# EAGLE schematic DashHubV5 (EAGLE 9.6.2)
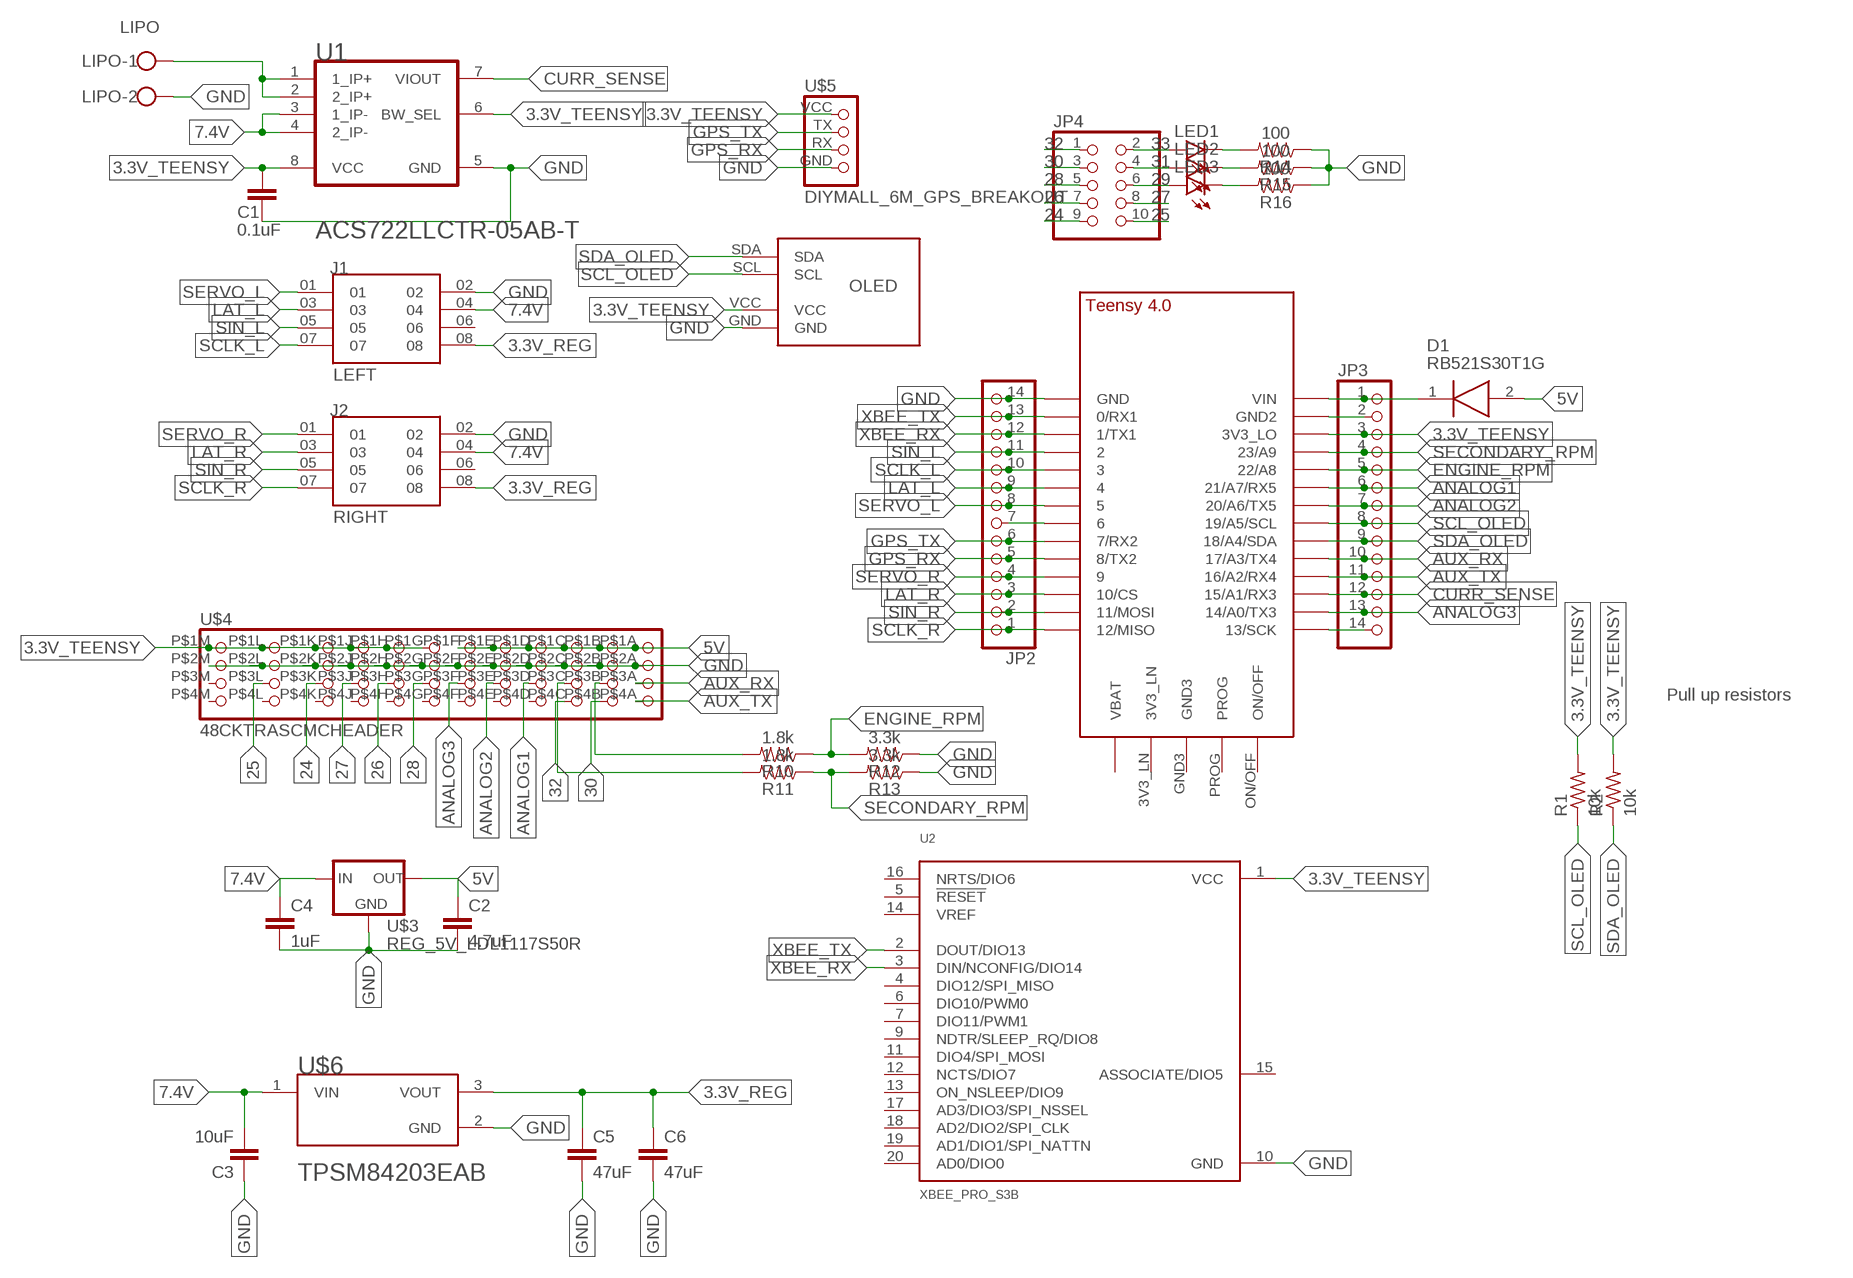
[diagram p0: schematic, sheet 1]

## Parts
C1  0.1uF  C-EUC0402  [C0402]
C2  4.7uF  CAP_SMDC0603  [C0603]
C3  10uF  CAP_SMDC1206  [C1206]
C4  1uF  CAP_SMDC1206  [C1206]
C5  47uF  CAP_SMDC1206  [C1206]
C6  47uF  CAP_SMDC1206  [C1206]
D1  RB521S30T1G  [SODFL1608X70N]
J1  LEFT  ESW-104-23-L-D  [SAMTEC_ESW-104-23-L-D]
J2  RIGHT  ESW-104-23-L-D  [SAMTEC_ESW-104-23-L-D]
JP2  PINHD-1X14  [1X14]
JP3  PINHD-1X14  [1X14]
JP4  PINHD-2X5  [2X05]
LED1  LEDCHIPLED_1206  [CHIPLED_1206]
LED2  LEDCHIPLED_1206  [CHIPLED_1206]
LED3  LEDCHIPLED_1206  [CHIPLED_1206]
LIPO  LIPO  W237-102  [W237-102]
R1  10k  RES_SMDR0603  [R0603]
R2  10k  RES_SMDR0603  [R0603]
R10  1.8k  RESISTORAXIAL-0.3  [AXIAL-0.3]
R11  1.8k  RESISTORAXIAL-0.3  [AXIAL-0.3]
R12  3.3k  RESISTORAXIAL-0.3  [AXIAL-0.3]
R13  3.3k  RESISTORAXIAL-0.3  [AXIAL-0.3]
R14  100  RESISTORAXIAL-0.3  [AXIAL-0.3]
R15  100  RESISTORAXIAL-0.3  [AXIAL-0.3]
R16  100  RESISTORAXIAL-0.3  [AXIAL-0.3]
U1  ALLEGRO_MICROSYSTEMS_ACS722LLCTR-05AB-TALLEGRO_MICROSYSTEMS_ACS722LLCTR-05AB-T_0_0  [ALLEGRO_MICROSYSTEMS_ACS722LLCTR-05AB-T_0]
U2  XBEE_PRO_S3B  [XBEE_PRO_S3B]
U$1  TEENSY_4.0-BASIC  [TEENSY_4.0-BASIC]
U$2  OLED_SSD1306  [OLED_SSD1306]
U$3  REG_5V_LDL1117S50R  [SOT230P700X180-4N]
U$4  48CKTRASCMCHEADER  [48CKTRASCMCHEADER]
U$5  DIYMALL_6M_GPS_BREAKOUT  [DIYMALL_6M_GPS_BREAKOUT]
U$6  TPSM84205EAB  [TPSM84205EAB]

## Nets
3.3V_REG: C5.1 C6.1 J1.08 J2.08 U$6.3(VOUT)
3.3V_TEENSY: C1.2 JP3.3 R1.2 R2.2 U1.6(BW_SEL) U1.8(VCC) U2.1(VCC) U$1.3V3_LO U$2.VCC U$4.P$1G(1G) U$4.P$1H(1H) U$4.P$1J(1J) U$4.P$1K(1K) U$4.P$1L(1L) U$4.P$1M(1M) U$5.VCC
5V: C2.1 D1.2(A) U$3.2(OUT) U$3.4(OUT) U$4.P$1A(1A) U$4.P$1B(1B) U$4.P$1C(1C) U$4.P$1D(1D) U$4.P$1E(1E) U$4.P$1F(1F)
7.4V: C3.2 C4.1 J1.04 J2.04 U1.3(1_IP-) U1.4(2_IP-) U$3.3(IN) U$6.1(VIN)
24: JP4.9 U$4.P$3K(3K)
25: JP4.10 U$4.P$3L(3L)
26: JP4.7 U$4.P$3H(3H)
27: JP4.8 U$4.P$3J(3J)
28: JP4.5 U$4.P$3G(3G)
29: JP4.6 LED3.A
30: JP4.3 U$4.P$4B(4B)
31: JP4.4 LED2.A
32: JP4.1 U$4.P$4C(4C)
33: JP4.2 LED1.A
ANALOG1: JP3.6 U$1.21/A7(21/A7/RX5) U$4.P$3D(3D)
ANALOG2: JP3.7 U$1.20/A6(20/A6/TX5) U$4.P$3E(3E)
ANALOG3: JP3.13 U$1.14/A0(14/A0/TX3) U$4.P$3F(3F)
AUX_RX: JP3.10 U$1.17/A3(17/A3/TX4) U$4.P$3A(3A)
AUX_TX: JP3.11 U$1.16/A2(16/A2/RX4) U$4.P$4A(4A)
CURR_SENSE: JP3.12 U1.7(VIOUT) U$1.15/A1(15/A1/RX3)
ENGINE_RPM: JP3.5 R10.P$1 R12.P$2 U$1.22/A8
GND: C1.1 C2.2 C3.1 C4.2 C5.2 C6.2 J1.02 J2.02 JP2.14 LIPO.2 R12.P$1 R13.P$1 R14.P$1 R15.P$1 R16.P$1 U1.5(GND) U2.10(GND) U$1.GND U$2.GND U$3.1(GND) U$4.P$2A(2A) U$4.P$2B(2B) U$4.P$2C(2C) U$4.P$2D(2D) U$4.P$2E(2E) U$4.P$2F(2F) U$4.P$2G(2G) U$4.P$2H(2H) U$4.P$2J(2J) U$4.P$2K(2K) U$4.P$2L(2L) U$4.P$2M(2M) U$5.GND U$6.2(GND)
GND2: JP3.2 U$1.GND2
GPS_RX: JP2.5 U$1.8(8/TX2) U$5.RX
GPS_TX: JP2.6 U$1.7(7/RX2) U$5.TX
LAT_L: J1.03 JP2.9 U$1.4/CANRX
LAT_R: J2.03 JP2.3 U$1.10/CS
LIPO_IN: LIPO.1 U1.1(1_IP+) U1.2(2_IP+)
N$1: JP2.7 U$1.6
N$2: D1.1(K) JP3.1 U$1.VIN
N$11: LED1.C R14.P$2
N$12: LED2.C R15.P$2
N$13: LED3.C R16.P$2
N$23: R10.P$2 U$4.P$3B(3B)
N$24: R11.P$2 U$4.P$3C(3C)
SCL_OLED: JP3.8 R1.1 U$1.19/A5/SCL U$2.SCL
SCLK_D: JP3.14 U$1.13/SCK
SCLK_L: J1.07 JP2.10 U$1.3/CANTX
SCLK_R: J2.07 JP2.1 U$1.12/MISO
SDA_OLED: JP3.9 R2.1 U$1.18/A4/SDA U$2.SDA
SECONDARY_RPM: JP3.4 R11.P$1 R13.P$2 U$1.23/A9
SERVO_L: J1.01 JP2.8 U$1.5
SERVO_R: J2.01 JP2.4 U$1.9/CS
SIN_L: J1.05 JP2.11 U$1.2
SIN_R: J2.05 JP2.2 U$1.11/MOSI
XBEE_RX: JP2.12 U2.3(DIN/NCONFIG/DIO14) U$1.1/TX(1/TX1)
XBEE_TX: JP2.13 U2.2(DOUT/DIO13) U$1.0/RX(0/RX1)
Unconnected: J1.06 J2.06 U2.4(DIO12/SPI_MISO) U2.5(!RESET) U2.6(DIO10/PWM0) U2.7(DIO11/PWM1) U2.9(NDTR/SLEEP_RQ/DIO8) U2.11(DIO4/SPI_MOSI) U2.12(NCTS/DIO7) U2.13(ON_NSLEEP/DIO9) U2.14(VREF) U2.15(ASSOCIATE/DIO5) U2.16(NRTS/DIO6) U2.17(AD3/DIO3/SPI_NSSEL) U2.18(AD2/DIO2/SPI_CLK) U2.19(AD1/DIO1/SPI_NATTN) U2.20(AD0/DIO0) U$1.3V3_LN U$1.GND3 U$1.ON/OFF U$1.PROG U$1.VBAT\(VBAT) U$4.P$3M(3M) U$4.P$4D(4D) U$4.P$4E(4E) U$4.P$4F(4F) U$4.P$4G(4G) U$4.P$4H(4H) U$4.P$4J(4J) U$4.P$4K(4K) U$4.P$4L(4L) U$4.P$4M(4M)

## Notes on the sheet
- Pull up resistors

## Library data of the parts
C1 = rcl:C-EU: CAPACITOR, European symbol; SPICEPREFIX: C
C2-C6 = GTOR - Passive Components:CAP_SMD: CAPACITOR, European symbol; SPICEPREFIX: C
D1 = RB521S30T1G:RB521S30T1G: Schottky Barrier Diode Source: Datasheet <http://www.onsemi.com/pub/Collateral/RB521S30T1-D.PDF>; ARROW_PART_NUMBER: RB521S30T1G; ARROW_PRICE-STOCK: https://www.arrow.com/en/products/rb521s30t1g/on-semiconductor; DESCRIPTION: Schottky Barrier Diode; HEIGHT: 0.7mm; MANUFACTURER_NAME: ON Semiconductor; MANUFACTURER_PART_NUMBER: RB521S30T1G; MOUSER_PART_NUMBER: 863-RB521S30T1G; MOUSER_PRICE-STOCK: https://www.mouser.co.uk/ProductDetail/ON-Semiconductor/RB521S30T1G?qs=xZq1yRCsb1eKFKS8TVH%2Fqg%3D%3D
J1 J2 = ESW-104-23-L-D:ESW-104-23-L-D; MANUFACTURER: Samtec Inc.; PARTREV: R; STANDARD: Manufacturer Recommendations
JP2 JP3 = pinhead:PINHD-1X14: PIN HEADER
JP4 = pinhead:PINHD-2X5: PIN HEADER
LED1-LED3 = led:LED: LED OSRAM: - CHIPLED LG R971, LG N971, LY N971, LG Q971, LY Q971, LO R971, LY R971 LH N974, LH R974 LS Q976, LO Q976, LY Q976 LO Q996 - Hyper CHIPLED LW Q18S LB Q993, LB Q99A, LB R99A - SideLED LS A670, LO A670, LY A670, LG A670, LP A670 LB A673, LV A673, LT A673, LW A673 LH A674 LY A675 LS A676, LA A676, LO A676, LY A676, LW A676 LS A679, LY A679, LG A679 - Hyper Micro SIDELED® LS Y876, LA Y876, LO Y876, LY Y876 LT Y87S - SmartLED LW L88C, LW L88S LB L89C, LB L89S, LG L890 LS L89K, LO L89K, LY L89K LS L896, LA L896, LO L896, LY L896 - TOPLED LS T670, LO T670, LY T670, LG T670, LP T670 LSG T670, LSP T670, LSY T670, LOP T670, LYG T670 LG T671, LOG T671, LSG T671 LB T673, LV T673, LT T673, LW T673 LH T674 LS T676, LA T676, LO T676, LY T676, LB T676, LH T676, LSB T676, LW T676 LB T67C, LV T67C, LT T67C, LS T67K, LO T67K, LY T67K, LW E67C LS E67B, LA E67B, LO E67B, LY E67B, LB E67C, LV E67C, LT E67C LW T67C LS T679, LY T679, LG T679 LS T770, LO T770, LY T770, LG T770, LP T770 LB T773, LV T773, LT T773, LW T773 LH T774 LS E675, LA E675, LY E675, LS T675 LS T776, LA T776, LO T776, LY T776, LB T776 LHGB T686 LT T68C, LB T68C - Hyper Mini TOPLED® LB M676 - Mini TOPLED Santana® LG M470 LS M47K, LO M47K, LY M47K Source: http://www.osram.convergy.de LUXEON: - LUMILED® LXK2-PW12-R00, LXK2-PW12-S00, LXK2-PW14-U00, LXK2-PW14-V00 LXK2-PM12-R00, LXK2-PM12-S00, LXK2-PM14-U00 LXK2-PE12-Q00, LXK2-PE12-R00, LXK2-PE12-S00, LXK2-PE14-T00, LXK2-PE14-U00 LXK2-PB12-K00, LXK2-PB12-L00, LXK2-PB12-M00, LXK2-PB14-N00, LXK2-PB14-P00, LXK2-PB14-Q00 LXK2-PR12-L00, LXK2-PR12-M00, LXK2-PR14-Q00, LXK2-PR14-R00 LXK2-PD12-Q00, LXK2-PD12-R00, LXK2-PD12-S00 LXK2-PH12-R00, LXK2-PH12-S00 LXK2-PL12-P00, LXK2-PL12-Q00, LXK2-PL12-R00 Source: www.luxeon.com KINGBRIGHT: KA-3528ASYC Source: www.kingbright.com
LIPO = con-wago-500:W237-102: WAGO SCREW CLAMP; MPN: 237-102; OC_FARNELL: unknown; OC_NEWARK: 70K9898
R1 R2 = GTOR - Passive Components:RES_SMD: RESISTOR, American symbol; SPICEPREFIX: R
R10-R16 = SparkFun-Resistors:RESISTOR: Generic Resistor Package
U1 = Allegro MicroSystems - ACS722LLCTR-05AB-T:ALLEGRO_MICROSYSTEMS_ACS722LLCTR-05AB-T: ALEG-ACS722-SOIC-8; CIIVA_IDS: 20395501; COMPONENT_LINK_1_DESCRIPTION: Manufacturer URL; COMPONENT_LINK_1_URL: http://www.allegromicro.com/; COMPONENT_LINK_3_DESCRIPTION: Package Specification; COMPONENT_LINK_3_URL: http://www.allegromicro.com/~/media/Files/Datasheets/ACS711-Datasheet.ashx?la=en; DATASHEET: http://www.allegromicro.com/~/media/Files/Datasheets/ACS722-Datasheet.ashx?la=en; FOOTPRINT_VARIANT_NAME_0: Manufacturer Recommended; IMPORTED: yes; IMPORTED_FROM: vault; IMPORT_TS: 1521843836; IP_MAX: 5 A; IP_MIN: -5 A; MF: Allegro MicroSystems; MOUNTING_TECHNOLOGY: Surface Mount; MPN: ACS722LLCTR-05AB-T; PACKAGE_DESCRIPTION: 8-Pin Small Outline Integrated Package, Body 4.9 x 3.9 mm, Pitch 1.27 mm; PACKING: Tape and Reel; PREFIX: U; RELEASE_DATE: 1439174706; ROHS: Yes; TEMPERATURE_MAX: 150 degC; TEMPERATURE_MIN: -40 degC; VAULT_GUID: 23CF8DBA-208E-4E0F-A1B8-C7EE78FE94DB; VAULT_REVISION: 60592E21-24CC-4A18-AB0C-D50A27DFFA24; VCC_MAX: 3.6 V; VCC_MIN: 3 V
U2 = GTOR - Microcontroller:XBEE_PRO_S3B: XBee-PRO 900HP DigiMesh 900 MHz 200 Kbps RF Module with U.FL Connector; DESCRIPTION: General ISM < 1GHz Transceiver Module 900MHz Antenna Not Included, RP-SMA Through Hole; DIGI-KEY_PART_NUMBER: 602-1293-ND; MF: Digi International; MP: XBP9B-XCST-001; PACKAGE: Module Digi International
U$1 = Teensy-4.0:TEENSY_4.0-BASIC
U$2 = GTOR - Breakout Boards:OLED_SSD1306
U$3 = GTOR - Active Components:REG_5V_LDL1117S50R
U$4 = GTOR - Connectors:48CKTRASCMCHEADER
U$5 = GTOR - Breakout Boards:DIYMALL_6M_GPS_BREAKOUT
U$6 = GTOR - Active Components:TPSM84205EAB